# Altium schematic sheet soc.SchDoc: RFSoC AMC
size A2; CompanyName: WUT; DrawnBy: T. Przywozki; Organization: WUT ISE; Address1: Warsaw University of Technology; Address2: Nowowiejska 15/19 00-665 Warsaw; Address3: Tomasz.Przywozki@pw.edu.pl; DocumentNumber: 1; Revision: 1; SheetNumber: 1; SheetTotal: 45; Project: RFSoC AMC; ModifiedBy: T. Przywozki; CreateDate: -; CheckedDate: -; DivGrp: ISE; Designer: T. Przywozki; ModifiedDate: -; ProjectName: ADC/DAC MEZZANINE
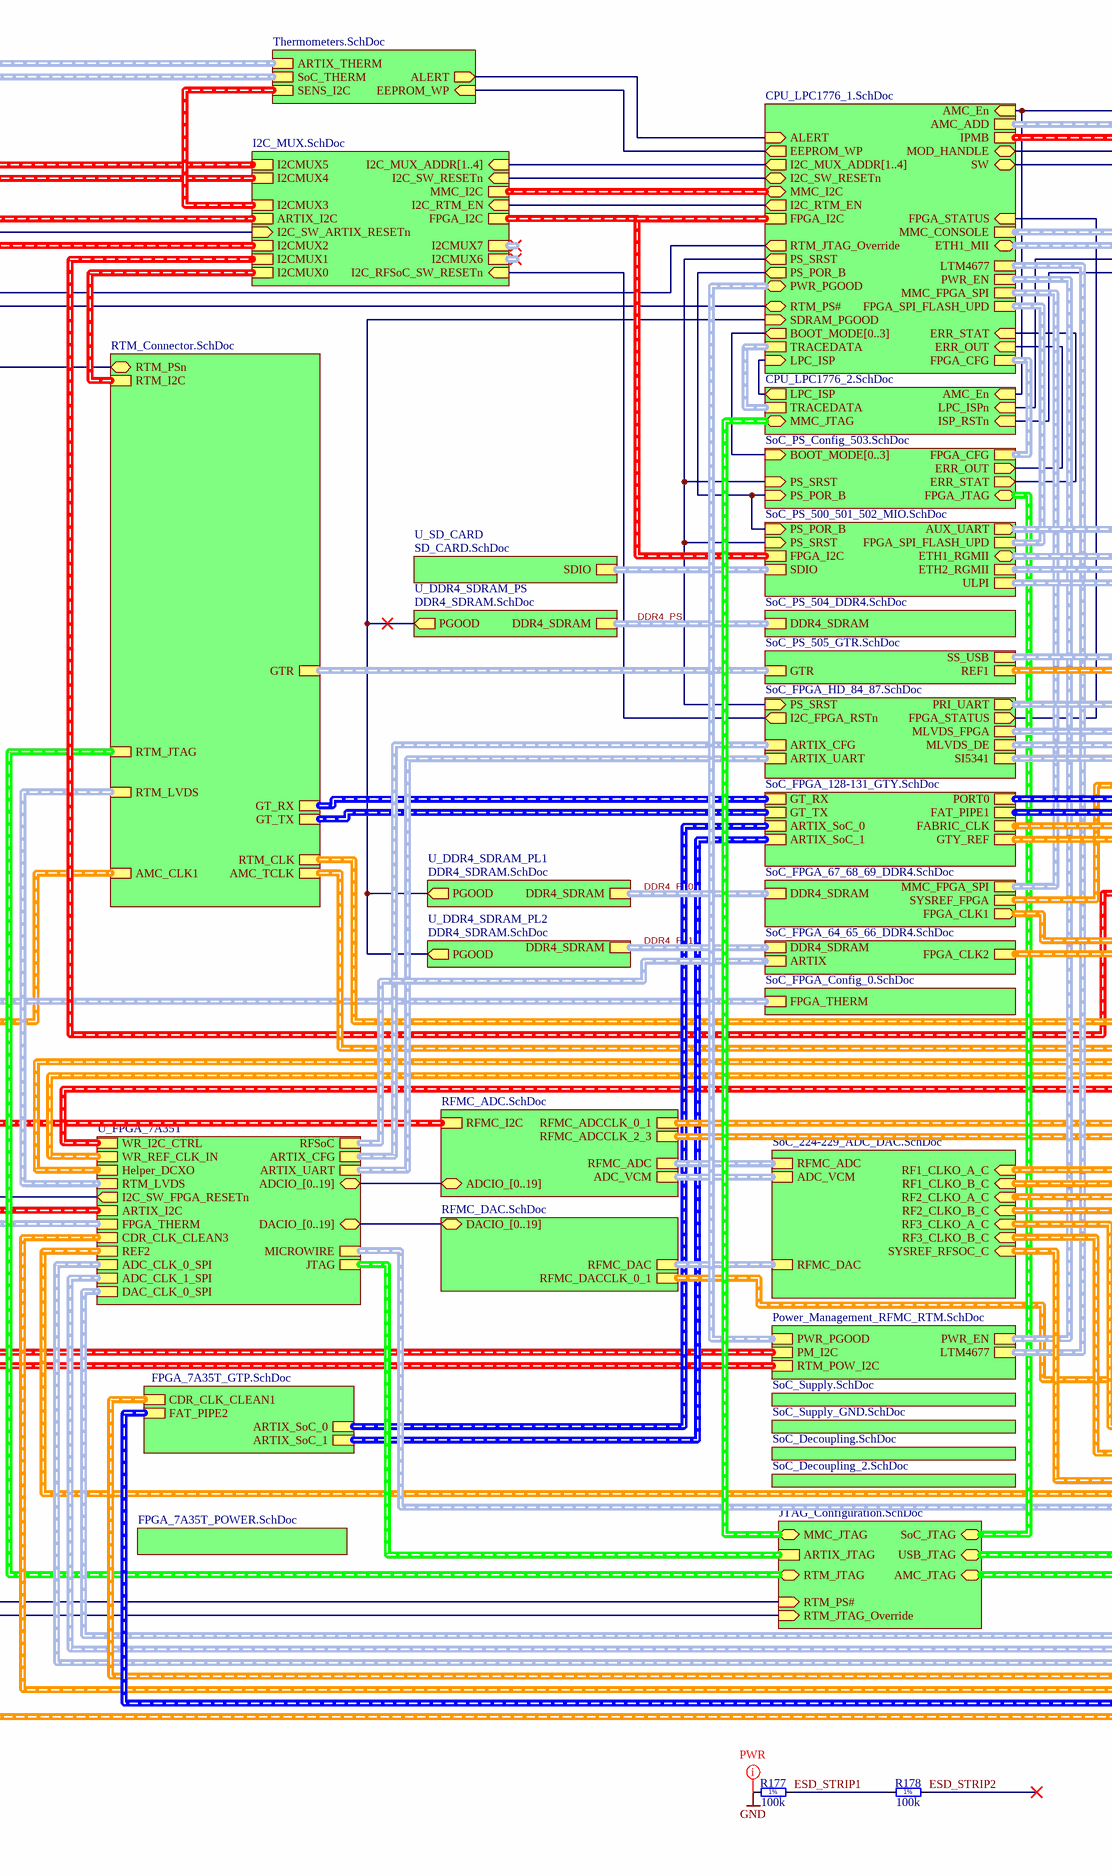
[diagram p0: soc.SchDoc, left]
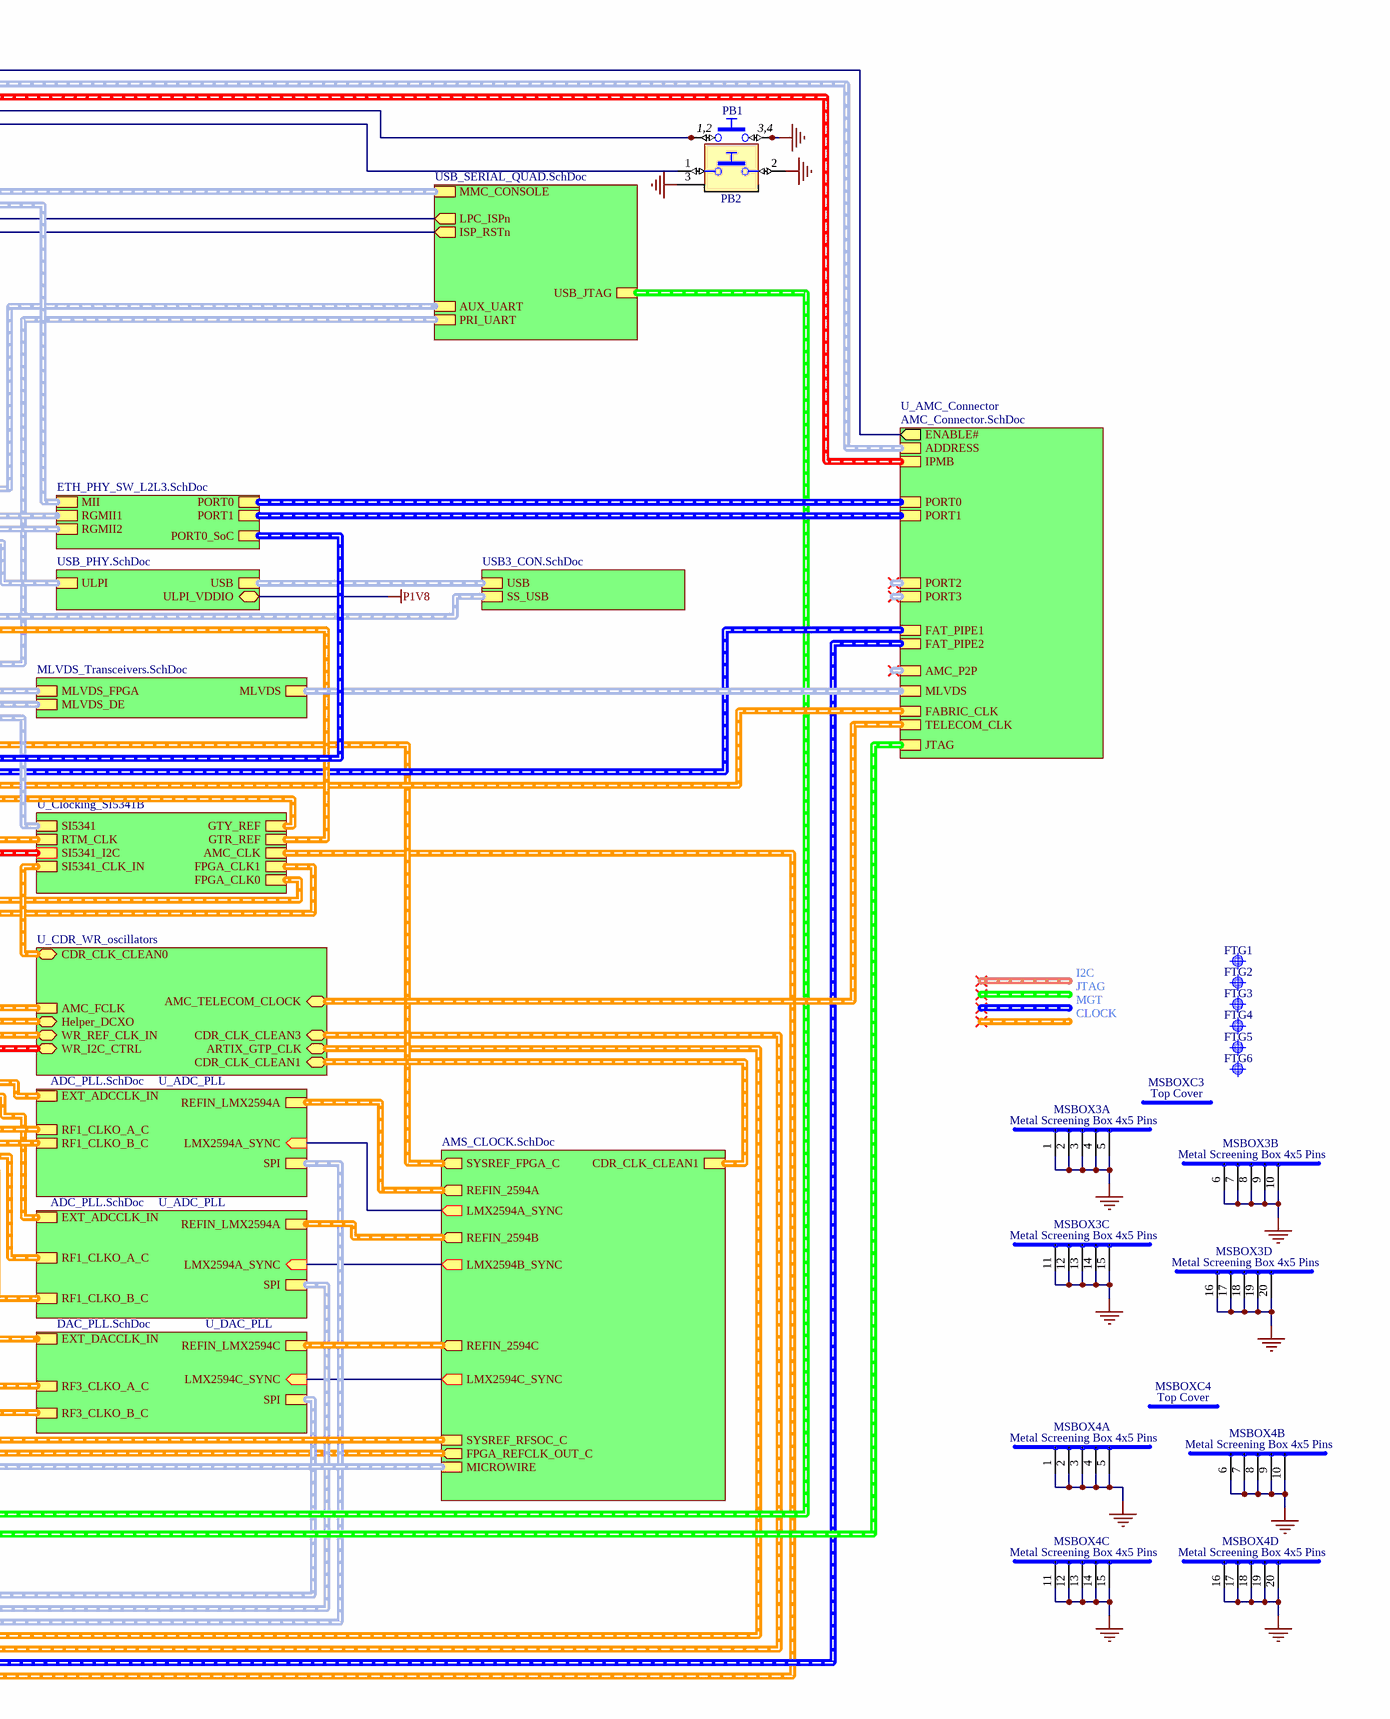
[diagram p1: soc.SchDoc, right]

## Parts
FTG1  Use only in PCB  [FIDUCIAL_TOP_C100-200]  (value not drawn)
FTG2  Use only in PCB  [FIDUCIAL_TOP_C100-200]  (value not drawn)
FTG3  Use only in PCB  [FIDUCIAL_TOP_S200-400]  (value not drawn)
FTG4  Use only in PCB  [FIDUCIAL_TOP_C100-200]  (value not drawn)
FTG5  Use only in PCB  [FIDUCIAL_TOP_C100-200]  (value not drawn)
FTG6  Use only in PCB  [FIDUCIAL_TOP_S200-400]  (value not drawn)
MSBOX3  Metal Screening Box 4x5 Pins  [MSBOX_WURTH_36103305]  (parts A,B,C,D of 4)
MSBOX4  Metal Screening Box 4x5 Pins  [MSBOX_WURTH_36103305]  (parts A,B,C,D of 4)
MSBOXC3  Top Cover  [MSBOX_WURTH_36003300]
MSBOXC4  Top Cover  [MSBOX_WURTH_36003300]
PB1  Push Button  [SW_C&K_HDT0001]  (value not drawn)
PB2  Push Button  [PB_OMRON_B3U-1100P]  (value not drawn)
R177  100k  [RESC3216X65N]
R178  100k  [RESC3216X65N]

## Sub-sheets
U_019 Zynq Decoupling = SoC_Decoupling.SchDoc: no entries
U_020 Zynq Decoupling 2 = SoC_Decoupling_2.SchDoc: no entries
U_ADC_PLL = ADC_PLL.SchDoc: LMX2594A_SYNC (in), RF1_CLKO_A_C (harness DIFF_CLK), RF1_CLKO_B_C (harness DIFF_CLK), REFIN_LMX2594A (harness DIFF_CLK), SPI (harness SPI), EXT_ADCCLK_IN (harness DIFF_2CLK)
U_ADC_PLL = ADC_PLL.SchDoc: LMX2594A_SYNC (in), RF1_CLKO_A_C (harness DIFF_CLK), RF1_CLKO_B_C (harness DIFF_CLK), REFIN_LMX2594A (harness DIFF_CLK), SPI (harness SPI), EXT_ADCCLK_IN (harness DIFF_2CLK)
U_AMC_Connector = AMC_Connector.SchDoc: JTAG (harness AMC_JTAG), TELECOM_CLK (harness AMC_TELECOM_CLOCK), ADDRESS (harness AMC_ADD), FABRIC_CLK (harness AMC_FABRIC_CLOCK), IPMB (harness I2C), ENABLE# (out), PORT0 (harness PORT0), PORT1 (harness PORT1), PORT2 (harness PORT2), PORT3 (harness PORT3), FAT_PIPE1 (harness FAT_PIPE1), FAT_PIPE2 (harness FAT_PIPE2), MLVDS (harness MLVDS), AMC_P2P (harness AMC_P2P)
U_AMS_CLOCK = AMS_CLOCK.SchDoc: LMX2594B_SYNC (out), LMX2594A_SYNC (out), LMX2594C_SYNC (out), SYSREF_FPGA_C (out, harness DIFF_CLK), REFIN_2594A (out, harness DIFF_CLK), REFIN_2594C (out, harness DIFF_CLK), REFIN_2594B (out, harness DIFF_CLK), FPGA_REFCLK_OUT_C (out, harness DIFF_CLK), SYSREF_RFSOC_C (harness SYSREF), CDR_CLK_CLEAN1 (harness DIFF_CLK), MICROWIRE (harness MICROWIRE)
U_CDR_WR_oscillators = CDR_WR_oscillators.SchDoc: WR_I2C_CTRL (bidir, harness WR_I2C_CTRL), AMC_TELECOM_CLOCK (bidir, harness AMC_TELECOM_CLOCK), CDR_CLK_CLEAN0 (bidir, harness DIFF_CLK), CDR_CLK_CLEAN1 (bidir, harness DIFF_CLK), WR_REF_CLK_IN (bidir, harness DIFF_CLK), Helper_DCXO (bidir, harness DIFF_CLK), CDR_CLK_CLEAN3 (bidir, harness DIFF_CLK), ARTIX_GTP_CLK (bidir, harness DIFF_CLK), AMC_FCLK (harness DIFF_CLK)
U_Clocking_SI5341B = Clocking_SI5341B.SchDoc: SI5341_I2C (harness I2C), GTR_REF (harness DIFF_CLK), SI5341_CLK_IN (harness DIFF_CLK), FPGA_CLK1 (harness DIFF_CLK), FPGA_CLK0 (harness DIFF_CLK), GTY_REF (harness GTY_CLK), SI5341 (harness SI5341B_CTRL), RTM_CLK (harness DIFF_CLK), AMC_CLK (harness DIFF_CLK)
U_CPU_LPC1776_1 = CPU_LPC1776_1.SchDoc: I2C_MUX_ADDR[1..4] (out), ETH1_MII (bidir, harness MII), MOD_HANDLE (bidir), SW (bidir), BOOT_MODE[0..3] (out), FPGA_SPI_FLASH_UPD (harness SPI_FLASH_UPD), RTM_PS# (bidir), PS_SRST (out), AMC_En (in), MMC_CONSOLE (harness UART), SDRAM_PGOOD (in), FPGA_I2C (harness I2C), MMC_I2C (bidir, harness I2C), IPMB (harness I2C), PWR_EN (harness PWR_EN), AMC_ADD (harness AMC_ADD), I2C_SW_RESETn (bidir), PWR_PGOOD (bidir, harness PWR_PGOOD), ALERT (in), FPGA_CFG (harness FPGA_CFG), MMC_FPGA_SPI (harness SPI), RTM_JTAG_Override (out), LTM4677 (harness LTM4677), LPC_ISP (in), FPGA_STATUS (in), PS_POR_B (out), EEPROM_WP (out), ERR_OUT (in), ERR_STAT (in), I2C_RTM_EN (out), TRACEDATA (harness TRACEDATA)
U_CPU_LPC1776_2 = CPU_LPC1776_2.SchDoc: MMC_JTAG (bidir, harness JTAG), LPC_ISPn (in), LPC_ISP (out), ISP_RSTn (in), AMC_En (in), TRACEDATA (harness TRACEDATA)
U_DAC_PLL = DAC_PLL.SchDoc: LMX2594C_SYNC (in), RF3_CLKO_B_C (harness DIFF_CLK), RF3_CLKO_A_C (harness DIFF_CLK), REFIN_LMX2594C (harness DIFF_CLK), SPI (harness SPI), EXT_DACCLK_IN (harness DIFF_2CLK)
U_DDR4_SDRAM_PL1 = DDR4_SDRAM.SchDoc: PGOOD (out), DDR4_SDRAM (harness DDR4)
U_DDR4_SDRAM_PL2 = DDR4_SDRAM.SchDoc: PGOOD (out), DDR4_SDRAM (harness DDR4)
U_DDR4_SDRAM_PS = DDR4_SDRAM.SchDoc: PGOOD (out), DDR4_SDRAM (harness DDR4)
U_ETH_PHY_SW_L2L3 = ETH_PHY_SW_L2L3.SchDoc: PORT0 (harness PORT0), PORT1 (harness PORT1), RGMII1 (harness RGMII), RGMII2 (harness RGMII), MII (harness MII), PORT0_SoC (harness PORT0)
U_FPGA_7A35T = FPGA_7A35T.SchDoc: JTAG (harness JTAG4), ARTIX_CFG (harness ARTIX_CFG), ARTIX_I2C (harness I2C), Helper_DCXO (harness DIFF_CLK), WR_I2C_CTRL (harness WR_I2C_CTRL), I2C_SW_FPGA_RESETn (out), REF2 (harness DIFF_CLK), FPGA_THERM (harness FPGA_TEMP), DAC_CLK_0_SPI (harness SPI), ADC_CLK_1_SPI (harness SPI), ADC_CLK_0_SPI (harness SPI), CDR_CLK_CLEAN3 (harness DIFF_CLK), ARTIX_UART (harness UART), MICROWIRE (harness MICROWIRE), WR_REF_CLK_IN (harness DIFF_CLK), RTM_LVDS (harness LVDS_PORT), RFSoC (harness RFSoC_ARTIX), DACIO_[0..19] (bidir), ADCIO_[0..19] (bidir)
U_FPGA_7A35T_GTP = FPGA_7A35T_GTP.SchDoc: CDR_CLK_CLEAN1 (harness DIFF_CLK), ARTIX_SoC_0 (harness GTx1_LINK), ARTIX_SoC_1 (harness GTx1_LINK), FAT_PIPE2 (harness FAT_PIPE2)
U_FPGA_7A35T_POWER = FPGA_7A35T_POWER.SchDoc: no entries
U_FPGA_SDRAM1 = SoC_FPGA_67_68_69_DDR4.SchDoc: DDR4_SDRAM (harness DDR4), FPGA_CLK1 (out, harness DIFF_CLK), SYSREF_FPGA (harness DIFF_CLK), MMC_FPGA_SPI (harness SPI)
U_FPGA_SDRAM2 = SoC_FPGA_64_65_66_DDR4.SchDoc: DDR4_SDRAM (harness DDR4), FPGA_CLK2 (harness DIFF_CLK), ARTIX
U_GTY_Transceivers = SoC_FPGA_128-131_GTY.SchDoc: GT_RX (harness GT_RX), GT_TX (harness GT_TX), GTY_REF (harness GTY_CLK), ARTIX_SoC_1 (harness GTx1_LINK), FAT_PIPE1 (harness FAT_PIPE1), PORT0 (harness PORT0), FABRIC_CLK (harness AMC_FABRIC_CLOCK), ARTIX_SoC_0 (harness GTx1_LINK)
U_I2C_MUX = I2C_MUX.SchDoc: I2C_MUX_ADDR[1..4] (in), I2C_SW_RESETn (in), FPGA_I2C (harness I2C), MMC_I2C (harness I2C), I2CMUX0 (harness I2C), I2CMUX1 (harness I2C), I2CMUX2 (harness I2C), I2CMUX3 (harness I2C), I2CMUX4 (harness I2C), I2CMUX5 (harness I2C), I2CMUX6 (harness I2C), I2C_SW_ARTIX_RESETn (in), ARTIX_I2C (harness I2C), I2C_RFSoC_SW_RESETn (in), I2CMUX7 (harness I2C), I2C_RTM_EN (in)
U_JTAG_Configuration = JTAG_Configuration.SchDoc: AMC_JTAG (bidir, harness AMC_JTAG), RTM_JTAG (bidir, harness JTAG4), USB_JTAG (bidir, harness USB_JTAG), MMC_JTAG (bidir, harness JTAG), RTM_JTAG_Override (in), SoC_JTAG (bidir, harness JTAG4), RTM_PS# (in), ARTIX_JTAG (harness JTAG4)
U_M-LVDS_PHY = MLVDS_Transceivers.SchDoc: MLVDS_FPGA (harness MLVDS-FPGA), MLVDS (harness MLVDS), MLVDS_DE (harness MLVDS_DE)
U_Power_Management_RFMC_RTM = Power_Management_RFMC_RTM.SchDoc: PM_I2C (harness I2C), PWR_EN (harness PWR_EN), LTM4677 (harness LTM4677), PWR_PGOOD (harness PWR_PGOOD), RTM_POW_I2C (harness I2C)
U_PS_DDR = SoC_PS_504_DDR4.SchDoc: DDR4_SDRAM (harness DDR4)
U_RFMC_ADC = RFMC_ADC.SchDoc: RFMC_ADC (harness RF_ADC), ADCIO_[0..19] (bidir), RFMC_I2C (harness I2C), ADC_VCM (harness ADC_VCM), RFMC_ADCCLK_0_1 (harness DIFF_2CLK), RFMC_ADCCLK_2_3 (harness DIFF_2CLK)
U_RFMC_DAC = RFMC_DAC.SchDoc: RFMC_DAC (harness RF_DAC), DACIO_[0..19] (bidir), RFMC_DACCLK_0_1 (harness DIFF_2CLK)
U_RTM_Connector = RTM_Connector.SchDoc: GT_RX (harness GT_RX), GT_TX (harness GT_TX), RTM_LVDS (harness LVDS_PORT), RTM_JTAG (harness JTAG4), RTM_PSn (bidir), RTM_I2C (harness I2C), GTR (harness GTR), AMC_TCLK (harness DIFF_CLK), AMC_CLK1 (harness DIFF_CLK), RTM_CLK (harness DIFF_CLK)
U_SD_CARD = SD_CARD.SchDoc: SDIO (harness SDIO)
U_SoC_ADC_DAC = SoC_224-229_ADC_DAC.SchDoc: RFMC_ADC (harness RF_ADC), RFMC_DAC (harness RF_DAC), RF1_CLKO_A_C (in, harness DIFF_CLK), RF1_CLKO_B_C (in, harness DIFF_CLK), RF2_CLKO_A_C (in, harness DIFF_CLK), RF2_CLKO_B_C (in, harness DIFF_CLK), RF3_CLKO_A_C (in, harness DIFF_CLK), RF3_CLKO_B_C (in, harness DIFF_CLK), SYSREF_RFSOC_C (in, harness SYSREF), ADC_VCM (harness ADC_VCM)
U_SoC_FPGA_Config_0 = SoC_FPGA_Config_0.SchDoc: FPGA_THERM (harness FPGA_TEMP)
U_SoC_FPGA_HD_84_87 = SoC_FPGA_HD_84_87.SchDoc: PRI_UART (out, harness UART), MLVDS_FPGA (harness MLVDS-FPGA), ARTIX_CFG (harness ARTIX_CFG), ARTIX_UART (harness UART), SI5341 (harness SI5341B_CTRL), PS_SRST (in), FPGA_STATUS (out), I2C_FPGA_RSTn (out), MLVDS_DE (harness MLVDS_DE)
U_SoC_PS = SoC_PS_500_501_502_MIO.SchDoc: ETH1_RGMII (bidir, harness RGMII), ULPI (harness ULPI), SDIO (harness SDIO), PS_POR_B (in), FPGA_I2C (harness I2C), FPGA_SPI_FLASH_UPD (harness SPI_FLASH_UPD), PS_SRST (in), ETH2_RGMII (harness RGMII), AUX_UART (out, harness UART)
U_SoC_PS_505_GTR = SoC_PS_505_GTR.SchDoc: REF1 (harness DIFF_CLK), SS_USB (harness SS_USB), GTR (harness GTR)
U_SoC_PS_Config_503 = SoC_PS_Config_503.SchDoc: BOOT_MODE[0..3] (in), PS_SRST (in), FPGA_JTAG (bidir, harness JTAG4), PS_POR_B (in), FPGA_CFG (harness FPGA_CFG), ERR_OUT (out), ERR_STAT (out)
U_SoC_Supply = SoC_Supply.SchDoc: no entries
U_SoC_Supply_GND = SoC_Supply_GND.SchDoc: no entries
U_Thermometers = Thermometers.SchDoc: SENS_I2C (harness I2C), ALERT (out), SoC_THERM (harness FPGA_TEMP), ARTIX_THERM (harness FPGA_TEMP), EEPROM_WP (in)
U_USB3_CON = USB3_CON.SchDoc: SS_USB (harness SS_USB), USB (harness USB)
U_USB_PHY = USB_PHY.SchDoc: ULPI (harness ULPI), ULPI_VDDIO (bidir), USB (harness USB)
U_USB_SERIAL_QUAD = USB_SERIAL_QUAD.SchDoc: MMC_CONSOLE (harness UART), USB_JTAG (harness USB_JTAG), LPC_ISPn (out), ISP_RSTn (out), AUX_UART (harness UART), PRI_UART (harness UART)

## Nets
GND: MSBOX3.1 MSBOX3.2 MSBOX3.3 MSBOX3.4 MSBOX3.5 MSBOX3.6 MSBOX3.7 MSBOX3.8 MSBOX3.9 MSBOX3.10 MSBOX3.11 MSBOX3.12 MSBOX3.13 MSBOX3.14 MSBOX3.15 MSBOX3.16 MSBOX3.17 MSBOX3.18 MSBOX3.19 MSBOX3.20 MSBOX4.1 MSBOX4.2 MSBOX4.3 MSBOX4.4 MSBOX4.5 MSBOX4.6 MSBOX4.7 MSBOX4.8 MSBOX4.9 MSBOX4.10 MSBOX4.11 MSBOX4.12 MSBOX4.13 MSBOX4.14 MSBOX4.15 MSBOX4.16 MSBOX4.17 MSBOX4.18 MSBOX4.19 MSBOX4.20 PB1.3 PB1.4 PB2.2 PB2.3 R177.1
P1V8: sheet U_USB_PHY/ULPI_VDDIO
ESD_STRIP1: R177.2 R178.1
ESD_STRIP2: R178.2
NetPB1_1: PB1.1 PB1.2 ; sheet U_CPU_LPC1776_1/MOD_HANDLE
NetPB2_1: PB2.1 ; sheet U_CPU_LPC1776_1/SW
(unnamed): sheet U_DDR4_SDRAM_PL1/PGOOD, sheet U_DDR4_SDRAM_PL2/PGOOD, sheet U_DDR4_SDRAM_PS/PGOOD, sheet U_CPU_LPC1776_1/SDRAM_PGOOD
(unnamed): sheet U_ADC_PLL/LMX2594A_SYNC, sheet U_AMS_CLOCK/LMX2594A_SYNC
(unnamed): sheet U_DAC_PLL/LMX2594C_SYNC, sheet U_AMS_CLOCK/LMX2594C_SYNC
(unnamed): sheet U_ADC_PLL/LMX2594A_SYNC, sheet U_AMS_CLOCK/LMX2594B_SYNC
(unnamed): sheet U_RTM_Connector/RTM_PSn, sheet U_CPU_LPC1776_1/RTM_PS#, sheet U_JTAG_Configuration/RTM_PS#
(unnamed): sheet U_AMC_Connector/ENABLE#, sheet U_CPU_LPC1776_1/AMC_En, sheet U_CPU_LPC1776_2/AMC_En
(unnamed): sheet U_CPU_LPC1776_1/PS_SRST, sheet U_SoC_FPGA_HD_84_87/PS_SRST, sheet U_SoC_PS_Config_503/PS_SRST, sheet U_SoC_PS/PS_SRST
(unnamed): sheet U_CPU_LPC1776_1/I2C_SW_RESETn, sheet U_I2C_MUX/I2C_SW_RESETn
(unnamed): sheet U_CPU_LPC1776_1/ALERT, sheet U_Thermometers/ALERT
(unnamed): sheet U_CPU_LPC1776_1/RTM_JTAG_Override, sheet U_JTAG_Configuration/RTM_JTAG_Override
(unnamed): sheet U_CPU_LPC1776_1/LPC_ISP, sheet U_CPU_LPC1776_2/LPC_ISP
(unnamed): sheet U_CPU_LPC1776_1/FPGA_STATUS, sheet U_SoC_FPGA_HD_84_87/FPGA_STATUS
(unnamed): sheet U_CPU_LPC1776_1/PS_POR_B, sheet U_SoC_PS_Config_503/PS_POR_B, sheet U_SoC_PS/PS_POR_B
(unnamed): sheet U_CPU_LPC1776_1/EEPROM_WP, sheet U_Thermometers/EEPROM_WP
(unnamed): sheet U_CPU_LPC1776_1/ERR_OUT, sheet U_SoC_PS_Config_503/ERR_OUT
(unnamed): sheet U_CPU_LPC1776_1/ERR_STAT, sheet U_SoC_PS_Config_503/ERR_STAT
(unnamed): sheet U_CPU_LPC1776_1/I2C_RTM_EN, sheet U_I2C_MUX/I2C_RTM_EN
(unnamed): sheet U_CPU_LPC1776_2/LPC_ISPn, sheet U_USB_SERIAL_QUAD/LPC_ISPn
(unnamed): sheet U_CPU_LPC1776_2/ISP_RSTn, sheet U_USB_SERIAL_QUAD/ISP_RSTn
(unnamed): sheet U_I2C_MUX/I2C_SW_ARTIX_RESETn, sheet U_FPGA_7A35T/I2C_SW_FPGA_RESETn
(unnamed): sheet U_I2C_MUX/I2C_RFSoC_SW_RESETn, sheet U_SoC_FPGA_HD_84_87/I2C_FPGA_RSTn

## Buses and harness runs
bus sheet U_CPU_LPC1776_1/BOOT_MODE[0..3] = sheet U_SoC_PS_Config_503/BOOT_MODE[0..3]
bus sheet U_CPU_LPC1776_1/I2C_MUX_ADDR[1..4] = sheet U_I2C_MUX/I2C_MUX_ADDR[1..4]
bus sheet U_FPGA_7A35T/ADCIO_[0..19] = sheet U_RFMC_ADC/ADCIO_[0..19]
bus sheet U_FPGA_7A35T/DACIO_[0..19] = sheet U_RFMC_DAC/DACIO_[0..19]
harness DDR4_PL0 = sheet U_DDR4_SDRAM_PL1/DDR4_SDRAM = sheet U_FPGA_SDRAM1/DDR4_SDRAM
harness DDR4_PL1 = sheet U_DDR4_SDRAM_PL2/DDR4_SDRAM = sheet U_FPGA_SDRAM2/DDR4_SDRAM
harness DDR4_PS = sheet U_DDR4_SDRAM_PS/DDR4_SDRAM = sheet U_PS_DDR/DDR4_SDRAM
harness sheet U_ADC_PLL/EXT_ADCCLK_IN = sheet U_RFMC_ADC/RFMC_ADCCLK_0_1
harness sheet U_ADC_PLL/EXT_ADCCLK_IN = sheet U_RFMC_ADC/RFMC_ADCCLK_2_3
harness sheet U_ADC_PLL/REFIN_LMX2594A = sheet U_AMS_CLOCK/REFIN_2594A
harness sheet U_ADC_PLL/REFIN_LMX2594A = sheet U_AMS_CLOCK/REFIN_2594B
harness sheet U_ADC_PLL/RF1_CLKO_A_C = sheet U_SoC_ADC_DAC/RF1_CLKO_A_C
harness sheet U_ADC_PLL/RF1_CLKO_A_C = sheet U_SoC_ADC_DAC/RF2_CLKO_A_C
harness sheet U_ADC_PLL/RF1_CLKO_B_C = sheet U_SoC_ADC_DAC/RF1_CLKO_B_C
harness sheet U_ADC_PLL/RF1_CLKO_B_C = sheet U_SoC_ADC_DAC/RF2_CLKO_B_C
harness sheet U_ADC_PLL/SPI = sheet U_FPGA_7A35T/ADC_CLK_0_SPI
harness sheet U_ADC_PLL/SPI = sheet U_FPGA_7A35T/ADC_CLK_1_SPI
harness sheet U_AMC_Connector/ADDRESS = sheet U_CPU_LPC1776_1/AMC_ADD
harness sheet U_AMC_Connector/FABRIC_CLK = sheet U_GTY_Transceivers/FABRIC_CLK
harness sheet U_AMC_Connector/FAT_PIPE1 = sheet U_GTY_Transceivers/FAT_PIPE1
harness sheet U_AMC_Connector/FAT_PIPE2 = sheet U_FPGA_7A35T_GTP/FAT_PIPE2
harness sheet U_AMC_Connector/IPMB = sheet U_CPU_LPC1776_1/IPMB
harness sheet U_AMC_Connector/JTAG = sheet U_JTAG_Configuration/AMC_JTAG
harness sheet U_AMC_Connector/MLVDS = sheet U_M-LVDS_PHY/MLVDS
harness sheet U_AMC_Connector/PORT0 = sheet U_ETH_PHY_SW_L2L3/PORT0
harness sheet U_AMC_Connector/PORT1 = sheet U_ETH_PHY_SW_L2L3/PORT1
harness sheet U_AMC_Connector/TELECOM_CLK = sheet U_CDR_WR_oscillators/AMC_TELECOM_CLOCK
harness sheet U_AMS_CLOCK/CDR_CLK_CLEAN1 = sheet U_CDR_WR_oscillators/CDR_CLK_CLEAN1
harness sheet U_AMS_CLOCK/FPGA_REFCLK_OUT_C = sheet U_FPGA_7A35T/REF2
harness sheet U_AMS_CLOCK/MICROWIRE = sheet U_FPGA_7A35T/MICROWIRE
harness sheet U_AMS_CLOCK/REFIN_2594C = sheet U_DAC_PLL/REFIN_LMX2594C
harness sheet U_AMS_CLOCK/SYSREF_FPGA_C = sheet U_FPGA_SDRAM1/SYSREF_FPGA
harness sheet U_AMS_CLOCK/SYSREF_RFSOC_C = sheet U_SoC_ADC_DAC/SYSREF_RFSOC_C
harness sheet U_CDR_WR_oscillators/AMC_FCLK = sheet U_RTM_Connector/AMC_TCLK
harness sheet U_CDR_WR_oscillators/ARTIX_GTP_CLK = sheet U_FPGA_7A35T_GTP/CDR_CLK_CLEAN1
harness sheet U_CDR_WR_oscillators/CDR_CLK_CLEAN0 = sheet U_Clocking_SI5341B/SI5341_CLK_IN
harness sheet U_CDR_WR_oscillators/CDR_CLK_CLEAN3 = sheet U_FPGA_7A35T/CDR_CLK_CLEAN3
harness sheet U_CDR_WR_oscillators/Helper_DCXO = sheet U_FPGA_7A35T/Helper_DCXO
harness sheet U_CDR_WR_oscillators/WR_I2C_CTRL = sheet U_FPGA_7A35T/WR_I2C_CTRL
harness sheet U_CDR_WR_oscillators/WR_REF_CLK_IN = sheet U_FPGA_7A35T/WR_REF_CLK_IN
harness sheet U_Clocking_SI5341B/AMC_CLK = sheet U_RTM_Connector/AMC_CLK1
harness sheet U_Clocking_SI5341B/FPGA_CLK0 = sheet U_FPGA_SDRAM1/FPGA_CLK1
harness sheet U_Clocking_SI5341B/FPGA_CLK1 = sheet U_FPGA_SDRAM2/FPGA_CLK2
harness sheet U_Clocking_SI5341B/GTR_REF = sheet U_SoC_PS_505_GTR/REF1
harness sheet U_Clocking_SI5341B/GTY_REF = sheet U_GTY_Transceivers/GTY_REF
harness sheet U_Clocking_SI5341B/RTM_CLK = sheet U_RTM_Connector/RTM_CLK
harness sheet U_Clocking_SI5341B/SI5341 = sheet U_SoC_FPGA_HD_84_87/SI5341
harness sheet U_Clocking_SI5341B/SI5341_I2C = sheet U_I2C_MUX/I2CMUX1
harness sheet U_CPU_LPC1776_1/ETH1_MII = sheet U_ETH_PHY_SW_L2L3/MII
harness sheet U_CPU_LPC1776_1/FPGA_CFG = sheet U_SoC_PS_Config_503/FPGA_CFG
harness sheet U_CPU_LPC1776_1/FPGA_I2C = sheet U_I2C_MUX/FPGA_I2C = sheet U_SoC_PS/FPGA_I2C
harness sheet U_CPU_LPC1776_1/FPGA_SPI_FLASH_UPD = sheet U_SoC_PS/FPGA_SPI_FLASH_UPD
harness sheet U_CPU_LPC1776_1/LTM4677 = sheet U_Power_Management_RFMC_RTM/LTM4677
harness sheet U_CPU_LPC1776_1/MMC_CONSOLE = sheet U_USB_SERIAL_QUAD/MMC_CONSOLE
harness sheet U_CPU_LPC1776_1/MMC_FPGA_SPI = sheet U_FPGA_SDRAM1/MMC_FPGA_SPI
harness sheet U_CPU_LPC1776_1/MMC_I2C = sheet U_I2C_MUX/MMC_I2C
harness sheet U_CPU_LPC1776_1/PWR_EN = sheet U_Power_Management_RFMC_RTM/PWR_EN
harness sheet U_CPU_LPC1776_1/PWR_PGOOD = sheet U_Power_Management_RFMC_RTM/PWR_PGOOD
harness sheet U_CPU_LPC1776_1/TRACEDATA = sheet U_CPU_LPC1776_2/TRACEDATA
harness sheet U_CPU_LPC1776_2/MMC_JTAG = sheet U_JTAG_Configuration/MMC_JTAG
harness sheet U_DAC_PLL/EXT_DACCLK_IN = sheet U_RFMC_DAC/RFMC_DACCLK_0_1
harness sheet U_DAC_PLL/RF3_CLKO_A_C = sheet U_SoC_ADC_DAC/RF3_CLKO_A_C
harness sheet U_DAC_PLL/RF3_CLKO_B_C = sheet U_SoC_ADC_DAC/RF3_CLKO_B_C
harness sheet U_DAC_PLL/SPI = sheet U_FPGA_7A35T/DAC_CLK_0_SPI
harness sheet U_ETH_PHY_SW_L2L3/PORT0_SoC = sheet U_GTY_Transceivers/PORT0
harness sheet U_ETH_PHY_SW_L2L3/RGMII1 = sheet U_SoC_PS/ETH1_RGMII
harness sheet U_ETH_PHY_SW_L2L3/RGMII2 = sheet U_SoC_PS/ETH2_RGMII
harness sheet U_FPGA_7A35T/ARTIX_CFG = sheet U_SoC_FPGA_HD_84_87/ARTIX_CFG
harness sheet U_FPGA_7A35T/ARTIX_I2C = sheet U_I2C_MUX/ARTIX_I2C
harness sheet U_FPGA_7A35T/ARTIX_UART = sheet U_SoC_FPGA_HD_84_87/ARTIX_UART
harness sheet U_FPGA_7A35T/FPGA_THERM = sheet U_Thermometers/ARTIX_THERM
harness sheet U_FPGA_7A35T/JTAG = sheet U_JTAG_Configuration/ARTIX_JTAG
harness sheet U_FPGA_7A35T/RFSoC = sheet U_FPGA_SDRAM2/ARTIX
harness sheet U_FPGA_7A35T/RTM_LVDS = sheet U_RTM_Connector/RTM_LVDS
harness sheet U_FPGA_7A35T_GTP/ARTIX_SoC_0 = sheet U_GTY_Transceivers/ARTIX_SoC_0
harness sheet U_FPGA_7A35T_GTP/ARTIX_SoC_1 = sheet U_GTY_Transceivers/ARTIX_SoC_1
harness sheet U_GTY_Transceivers/GT_RX = sheet U_RTM_Connector/GT_RX
harness sheet U_GTY_Transceivers/GT_TX = sheet U_RTM_Connector/GT_TX
harness sheet U_I2C_MUX/I2CMUX0 = sheet U_RTM_Connector/RTM_I2C
harness sheet U_I2C_MUX/I2CMUX2 = sheet U_RFMC_ADC/RFMC_I2C
harness sheet U_I2C_MUX/I2CMUX3 = sheet U_Thermometers/SENS_I2C
harness sheet U_I2C_MUX/I2CMUX4 = sheet U_Power_Management_RFMC_RTM/PM_I2C
harness sheet U_I2C_MUX/I2CMUX5 = sheet U_Power_Management_RFMC_RTM/RTM_POW_I2C
harness sheet U_JTAG_Configuration/RTM_JTAG = sheet U_RTM_Connector/RTM_JTAG
harness sheet U_JTAG_Configuration/SoC_JTAG = sheet U_SoC_PS_Config_503/FPGA_JTAG
harness sheet U_JTAG_Configuration/USB_JTAG = sheet U_USB_SERIAL_QUAD/USB_JTAG
harness sheet U_M-LVDS_PHY/MLVDS_DE = sheet U_SoC_FPGA_HD_84_87/MLVDS_DE
harness sheet U_M-LVDS_PHY/MLVDS_FPGA = sheet U_SoC_FPGA_HD_84_87/MLVDS_FPGA
harness sheet U_RFMC_ADC/ADC_VCM = sheet U_SoC_ADC_DAC/ADC_VCM
harness sheet U_RFMC_ADC/RFMC_ADC = sheet U_SoC_ADC_DAC/RFMC_ADC
harness sheet U_RFMC_DAC/RFMC_DAC = sheet U_SoC_ADC_DAC/RFMC_DAC
harness sheet U_RTM_Connector/GTR = sheet U_SoC_PS_505_GTR/GTR
harness sheet U_SD_CARD/SDIO = sheet U_SoC_PS/SDIO
harness sheet U_SoC_FPGA_Config_0/FPGA_THERM = sheet U_Thermometers/SoC_THERM
harness sheet U_SoC_FPGA_HD_84_87/PRI_UART = sheet U_USB_SERIAL_QUAD/PRI_UART
harness sheet U_SoC_PS/AUX_UART = sheet U_USB_SERIAL_QUAD/AUX_UART
harness sheet U_SoC_PS/ULPI = sheet U_USB_PHY/ULPI
harness sheet U_SoC_PS_505_GTR/SS_USB = sheet U_USB3_CON/SS_USB
harness sheet U_USB3_CON/USB = sheet U_USB_PHY/USB

## Layout directives
net class PWR: GND

## Notes on the sheet
- I2C
- JTAG
- MGT
- CLOCK
- Project/Equipment
- Document
- Designer
- Drawn by
- Check.by
- Last Mod.
- Copyright WUT ISE 2021
  This documentation describes Open Hardware and is licensed under CERN OHL v.1.1. You may redistribute and modify this documentaction under the terms of the CERN OHL v1.1.
  (http://ohwr.org/CERNOHL). This documentation is dristributed WITHOUT ANY EXPRESS OR IMPLIED WARRANTY, INCLUDING OF MERCHANTABLITY, SATISFACTORY QUALITY AND FITNESS FOR A PARTICULAR PURPOSE. Please see the CERN OHL v.1.1 for applicable conditions
- Contact:
- File
- Print Date
- Sheet
- Size
- A2
- of
- Rev
- (in symbol R1206_100K_1%_0.25W_100PPM) 1%
- (in symbol SW_C&K_HDT0001) 1,2; 3,4

## Library data of the parts
FTG1 FTG2 FTG4 FTG5 = FIDUCIAL_TARGET_C100-200: Fiducial Target; Part Description: Round Fiducial Target, Top Layer, 1.0mm, Top Solder 2.0mm, Keepout =2.0mm; Mounted: No; PackageDescription: Round Fiducial Target, Top Layer, 1.0mm, Top Solder 2.0mm, Keepout =2.0mm; Part Number: FIDUCIAL_TARGET_C100-200; Component Kind: Standard (No BOM); Component Type: Standard (No BOM); Pin Count: 1; Family: Fiducial; Socket: No; SMD: Yes; Sense: No; Status: None; ComponentHeight: 0mm; HelpURL: Undefined; Author: CERN DEM JLC; CreateDate: 09.02.2010; LatestRevisionDate: 04.04.2012
FTG3 FTG6 = FIDUCIAL_TARGET_S200-400: Fiducial Target; Part Description: Square Fiducial Target, Top Layer, 2.0mm, Top Solder 4.0mm, Keepout =4.0mm; Mounted: No; PackageDescription: Square Fiducial Target, Top Layer, 2.0mm, Top Solder 4.0mm, Keepout =4.0mm; Part Number: FIDUCIAL_TARGET_S200-400; Component Kind: Standard (No BOM); Component Type: Standard (No BOM); Pin Count: 1; Family: Fiducial; Socket: No; SMD: Yes; Sense: No; Status: None; ComponentHeight: 0mm; HelpURL: Undefined; Author: CERN DEM JLC; CreateDate: 02.06.2008; LatestRevisionDate: 04.04.2012
MSBOX3 MSBOX4 = MSBOX_WURTH_36103305: Metal Screening Box 20 (4x5) Pins; Part Description: Shielding Cabinet SMD-Frame WE-SHC, Internal Dimensions 30 x 30mm; Manufacturer: WURTH; PressFit: No; Part Number: MSBOX_WURTH_36103305; Component Kind: Standard; Component Type: Standard; Pin Count: 20; PackageDescription: Shielding Cabinet SMD-Frame WE-SHC, Internal Dimensions 30 x 30mm; Mounted: Yes; Socket: No; SMD: Yes; Sense: No; Status: None; Manufacturer Part Number: 36103305; ComponentHeight: 3.1mm; HelpURL: \\cern.ch\dfs\Applications\Altium\Datasheets\MSBOX_WURTH_36103305.pdf; Author: CERN DEM JLC; CreateDate: 02/07/2012; LatestRevisionDate: 02/07/2012
MSBOXC3 MSBOXC4 = MSBOX_WURTH_36003300: Metal Screening Box - Top Cover 0 Pin; Part Description: Top Cover For 30 x 30mm WE-SHC Shielding Cabinet; Manufacturer: WURTH; PressFit: No; Part Number: MSBOX_WURTH_36003300; Component Kind: Accessories; Component Type: Standard; Pin Count: 0; PackageDescription: Top Cover For 30 x 30mm WE-SHC Shielding Cabinet; Mounted: Yes; Socket: No; SMD: No; Sense: No; Status: None; Manufacturer Part Number: 36003300; ComponentHeight: 3.1mm; HelpURL: \\cern.ch\dfs\Applications\Altium\Datasheets\MSBOX_WURTH_36003300.pdf; Author: CERN DEM JLC; CreateDate: 02.07.2012; LatestRevisionDate: 02.07.2012
PB1 = SW_C&K_HDT0001: Push-Button Switch SPDT; Manufacturer: C&K; Part Description: 5VDC 1mA SPST-NO Micro Mini Surface Surface Mount Detect Push-Button Switch, HDT Series; PressFit: No; Manufacturer Part Number: HDT0001; PackageDescription: Body 3.5x2.8mm, Micro Mini Surface Mount Detect Switches, HDT Serie; Part Number: SW_C&K_HDT0001; Component Kind: Standard; Component Type: Standard; Pin Count: 4; Family: Push Button; Mounted: Yes; Socket: No; SMD: Yes; Sense: No; Status: None; ComponentHeight: 3.35mm; HelpURL: \\cern.ch\dfs\Applications\Altium\Datasheets\SW_C&K_HDT0001.pdf; Author: CERN DEM JLC; CreateDate: 15.08.2012; LatestRevisionDate: 15.08.2012
PB2 = PB_OMRON_B3U-1100P: Push-Button Switch SPDT; Part Description: 3x2.5mm Ultra-Small Tactile SPST Pushbutton Switch (with Ground Terminal),Contact Rating 50mA 12VDC, B3U Series; Manufacturer: OMRON; PressFit: No; Part Number: PB_OMRON_B3U-1100P; Component Kind: Standard; Component Type: Standard; Pin Count: 3; PackageDescription: Body 1.2x3x2.5mm Ultra-Small Tactile SPST Pushbutton Switch, (with Ground Terminal), OMRON B3U Series; Family: Push Button; Mounted: Yes; Socket: No; SMD: Yes; Sense: No; Status: None; Manufacturer Part Number: PB_OMRON_B3U-1100P; ComponentHeight: 1.75mm; HelpURL: \\cern.ch\dfs\Applications\Altium\Datasheets\PB_OMRON_B3U-1100P.pdf; Author: CERN DEM JLC; CreateDate: 16.03.2010; LatestRevisionDate: 16.03.2010
R177 R178 = R1206_100K_1%_0.25W_100PPM: Resistor - 1%; Part Description: General Purpose Thick Film Chip Resistor; Manufacturer: GENERIC; Manufacturer1 Part Number: NRC12F1003TRF; Power: 0.25W; TC: ±100ppm/°C; Table: Resistors SMD; Part Number: R1206_100K_1%_0.25W_100PPM; Component Kind: Standard; Component Type: Standard; Pin Count: 2; Value: 100k; Status: Preferred; Tolerance: ±1%; Manufacturer Part Number: R1206_100K_1%_0.25W_100PPM; Case: 1206; Mounted: Yes; Socket: No; SMD: Yes; Manufacturer1 Example: NIC COMPONENT; Manufacturer1 ComponentHeight: 0.65mm; HelpURL: \\cern.ch\dfs\Applications\Altium\Datasheets\R1206_NIC_NRC.pdf; Author: CERN DEM JLC; CreateDate: 2007-12-03; LatestRevisionDate: 2008-03-13